# Altium schematic sheet MCU_Module.SchDoc: MCU Module
size A3; DocumentNumber: 4; SheetNumber: 4; SheetTotal: 51
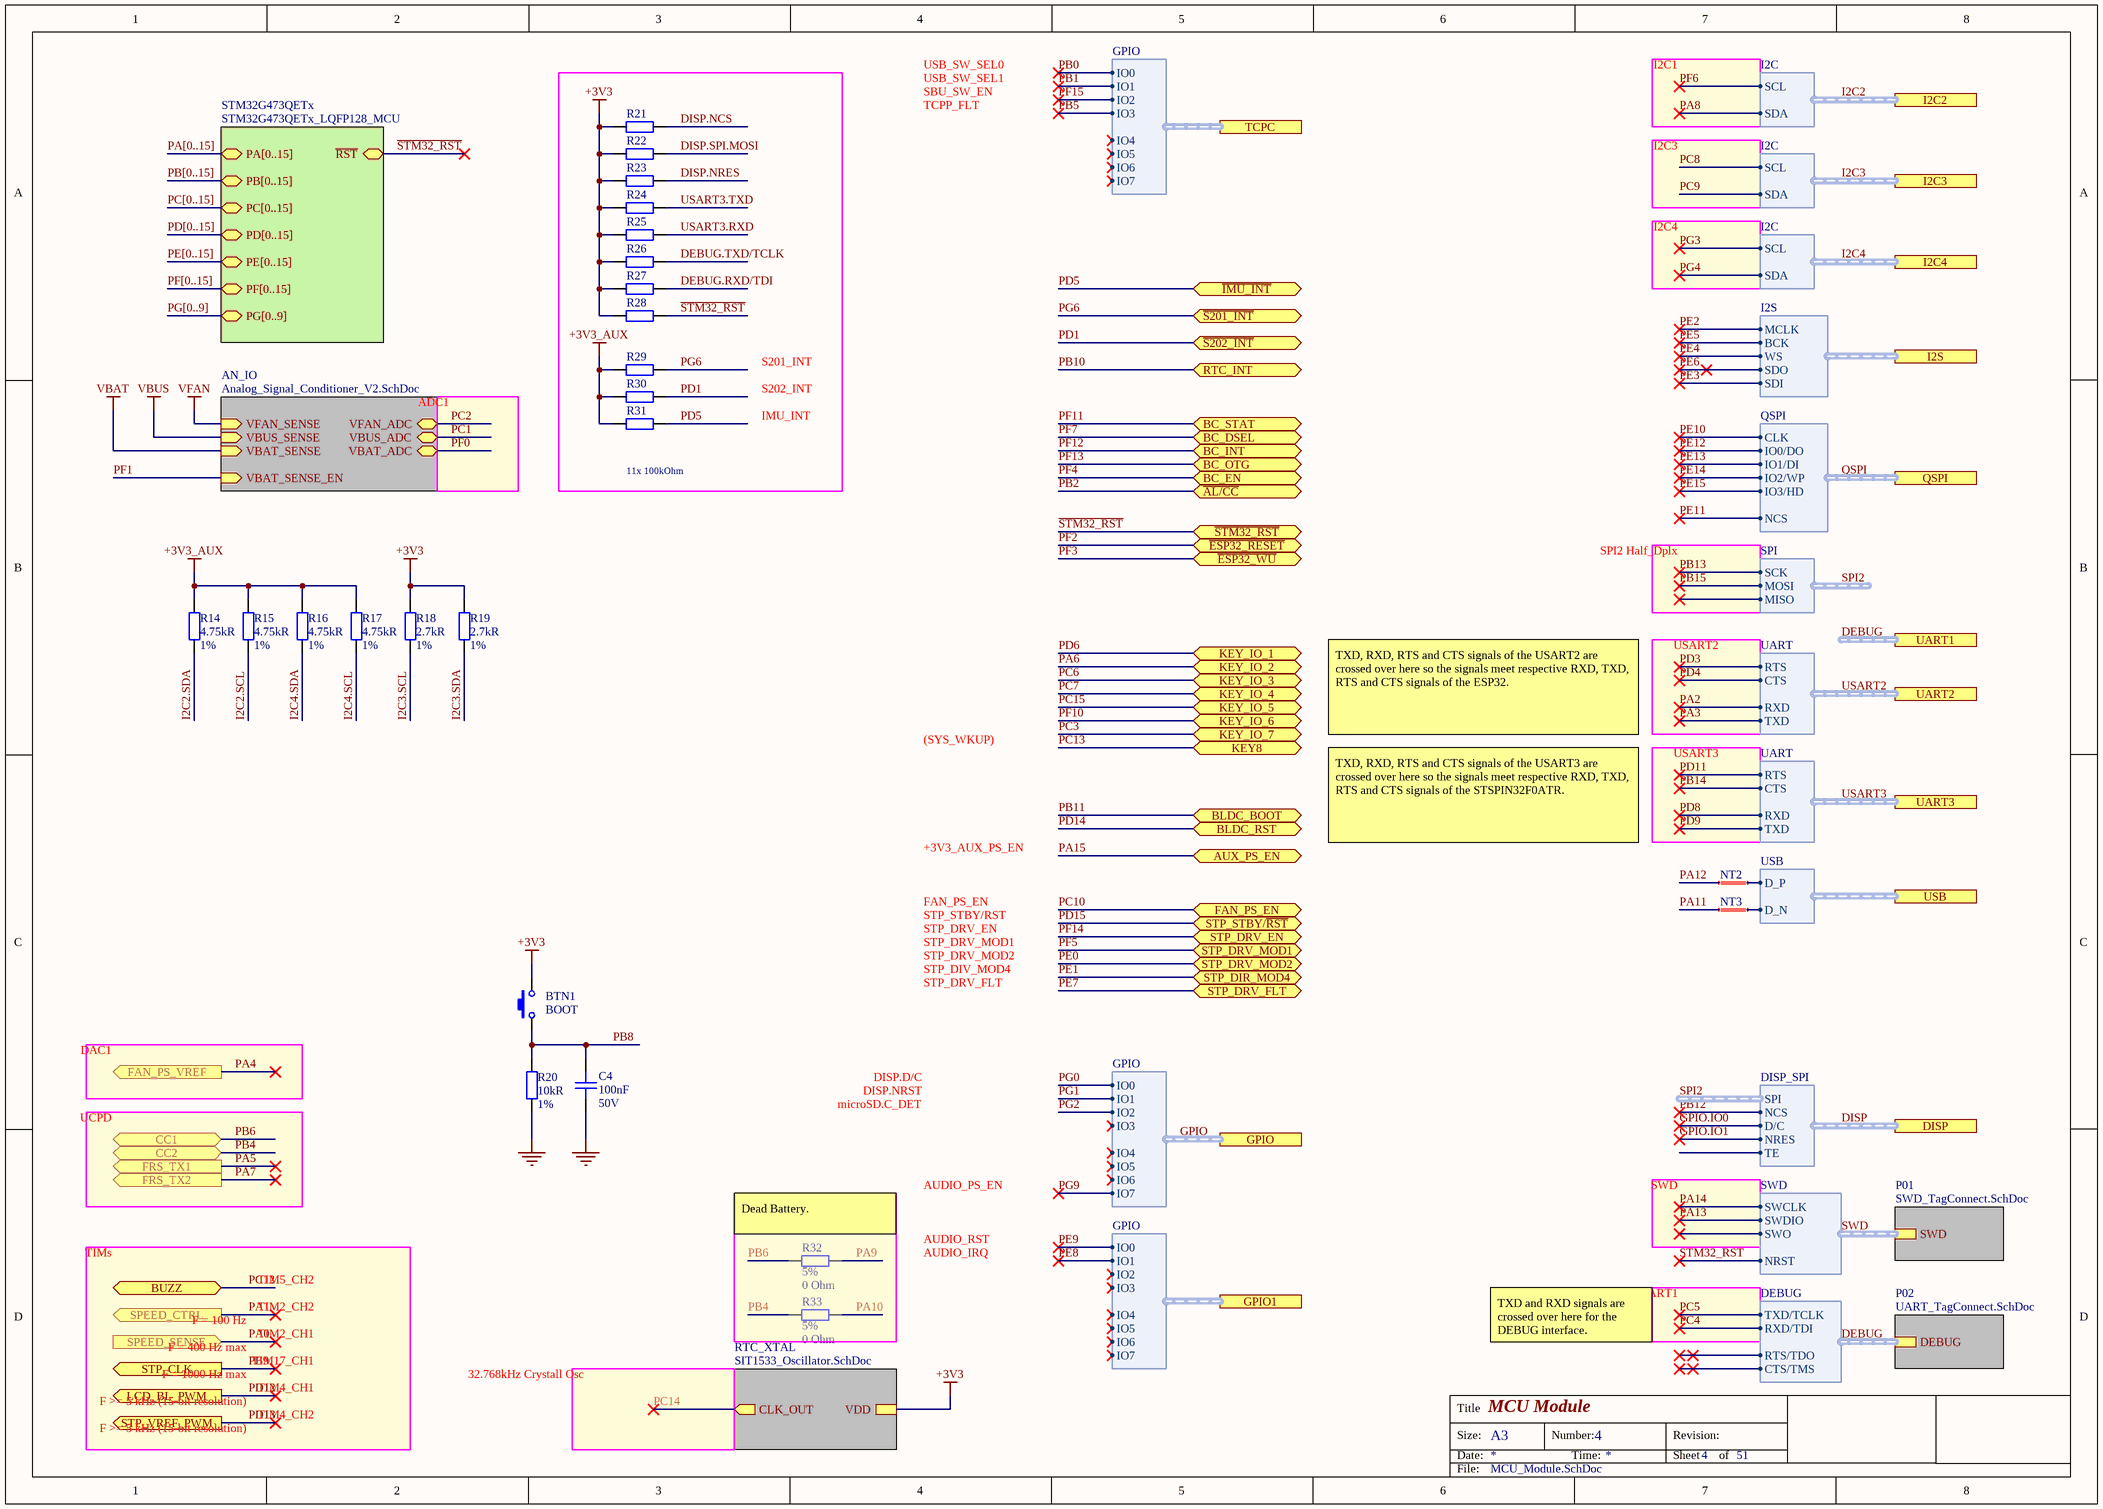
[diagram p0: MCU_Module.SchDoc]

## Parts
BTN1  BOOT  [SWITCH USLPT2819DT2TR TACTILE TE]
C4  Capacitance: 100nF  Voltage: 50V  [C0402]  (hidden comment: CAP CER 0.1UF 50V X7R 0402)
NT2  Net Tie  [Net Tie 6x30mil]  (value not drawn)  (net tie, no BOM)
NT3  Net Tie  [Net Tie 6x30mil]  (value not drawn)  (net tie, no BOM)
R14  Resistance: 4.75kR  Tolerance: 1%  [R0402]  (hidden comment: RES SMD 4.75K OHM 1% 1/16W 0402)
R15  Resistance: 4.75kR  Tolerance: 1%  [R0402]  (hidden comment: RES SMD 4.75K OHM 1% 1/16W 0402)
R16  Resistance: 4.75kR  Tolerance: 1%  [R0402]  (hidden comment: RES SMD 4.75K OHM 1% 1/16W 0402)
R17  Resistance: 4.75kR  Tolerance: 1%  [R0402]  (hidden comment: RES SMD 4.75K OHM 1% 1/16W 0402)
R18  Resistance: 2.7kR  Tolerance: 1%  [R0402]  (hidden comment: RES SMD 2.7K OHM 1% 1/16W 0402)
R19  Resistance: 2.7kR  Tolerance: 1%  [R0402]  (hidden comment: RES SMD 2.7K OHM 1% 1/16W 0402)
R20  Resistance: 10kR  Tolerance: 1%  [R0402]  (hidden comment: RES SMD 10K OHM 1% 1/16W 0402)
R21  RES SMD 100K OHM 1% 1/16W 0402  [R0402]  (value not drawn)
R22  RES SMD 100K OHM 1% 1/16W 0402  [R0402]  (value not drawn)
R23  RES SMD 100K OHM 1% 1/16W 0402  [R0402]  (value not drawn)
R24  RES SMD 100K OHM 1% 1/16W 0402  [R0402]  (value not drawn)
R25  RES SMD 100K OHM 1% 1/16W 0402  [R0402]  (value not drawn)
R26  RES SMD 100K OHM 1% 1/16W 0402  [R0402]  (value not drawn)
R27  RES SMD 100K OHM 1% 1/16W 0402  [R0402]  (value not drawn)
R28  RES SMD 100K OHM 1% 1/16W 0402  [R0402]  (value not drawn)
R29  RES SMD 100K OHM 1% 1/16W 0402  [R0402]  (value not drawn)
R30  RES SMD 100K OHM 1% 1/16W 0402  [R0402]  (value not drawn)
R31  RES SMD 100K OHM 1% 1/16W 0402  [R0402]  (value not drawn)
R32  Tolerance: 5%  Resistance: 0 Ohm  [R0402]  (hidden comment: RES SMD 0 OHM JUMPER 1/16W 0402)
R33  Tolerance: 5%  Resistance: 0 Ohm  [R0402]  (hidden comment: RES SMD 0 OHM JUMPER 1/16W 0402)

## Sub-sheets
AN_IO = Analog_Signal_Conditioner_V2.SchDoc: VFAN_SENSE (in), VBUS_SENSE (in), VFAN_ADC (bidir), VBUS_ADC (bidir), VBAT_SENSE (in), VBAT_ADC (bidir), VBAT_SENSE_EN (in)
P01 = SWD_TagConnect.SchDoc: SWD (harness SWD)  | Caption: SWD
P02 = UART_TagConnect.SchDoc: DEBUG (harness DEBUG)  | Caption: DEBUG
RTC_XTAL = SIT1533_Oscillator.SchDoc: CLK_OUT (out), VDD
STM32G473QETx = STM32G473QETx_LQFP128_MCU: ~{RST} (bidir), PA[0..15] (bidir), PB[0..15] (bidir), PC[0..15] (bidir), PF[0..15] (bidir), PD[0..15] (bidir), PE[0..15] (bidir), PG[0..9] (bidir)

## Ports
AUX_PS_EN (bidir), BC_DSEL (bidir), BC_EN (bidir), BC_INT (bidir), BC_OTG (bidir), BC_STAT (bidir), BLDC_BOOT (bidir), BLDC_RST (bidir), BUZZ (bidir), CC1 (bidir), CC2 (bidir), DISP (harness DISP_SPI), FAN_PS_EN (bidir), FAN_PS_VREF (out), FRS_TX1 (out), FRS_TX2 (out), GPIO1 (harness GPIO), GPIO (harness GPIO), I2C2 (harness I2C), I2C3 (harness I2C), I2C4 (harness I2C), I2S (harness I2S), KEY8 (bidir), KEY_IO_1 (bidir), KEY_IO_2 (bidir), KEY_IO_3 (bidir), KEY_IO_4 (bidir), KEY_IO_5 (bidir), KEY_IO_6 (bidir), KEY_IO_7 (bidir), LCD_BL_PWM (out), QSPI (harness QSPI), RTC_INT (bidir), SPEED_CTRL (out), SPEED_SENSE (in), STP_CLK (out), STP_DIR_MOD4 (bidir), STP_DRV_EN (bidir), STP_DRV_FLT (bidir), STP_DRV_MOD1 (bidir), STP_DRV_MOD2 (bidir), STP_STBY/~{RST} (bidir), STP_VREF_PWM (out), TCPC (harness GPIO), UART1 (harness DEBUG), UART2 (harness UART), UART3 (harness UART), USB (harness USB), ~{AL/CC} (bidir), ~{ESP32_RESET} (bidir), ~{ESP32_WU} (bidir), ~{IMU_INT} (bidir), ~{S201_INT} (bidir), ~{S202_INT} (bidir), ~{STM32_RST} (bidir)

## Harnesses
SWD: SWDIO, SWCLK, NRST, SWO
DEBUG: TXD/TCLK, RXD/TDI, RTS/TDO, CTS/TMS
DISP_SPI: SPI, NCS, D/C, NRES, TE
USB: D_P, D_N
SPI: SCK, MISO, MOSI
QSPI: IO0/DO, IO1/DI, NCS, CLK, IO2/WP, IO3/HD
I2S: WS, SDI, BCK, SDO, MCLK
I2C: SCL, SDA
UART: RTS, CTS, RXD, TXD
GPIO: IO0, IO1, IO2, IO3, IO4, IO5, IO6, IO7
GPIO: IO0, IO1, IO2, IO4, IO6, IO7, IO3, IO5

## Nets
+3V3: BTN1.1 R18.2 R19.2 R21.1 R22.1 R23.1 R24.1 R25.1 R26.1 R27.1 R28.1 ; sheet RTC_XTAL/VDD
+3V3_AUX: R14.2 R15.2 R16.2 R17.2 R29.1 R30.1 R31.1
GND: C4.1 R20.2
VBAT: sheet AN_IO/VBAT_SENSE
VBUS: sheet AN_IO/VBUS_SENSE
VFAN: sheet AN_IO/VFAN_SENSE
~{STM32_RST}: R28.2 ; port ~{STM32_RST}, sheet STM32G473QETx/~{RST}, sheet P01/SWD.NRST
DEBUG.RXD/TDI: R27.2
DEBUG.TXD/TCLK: R26.2
DISP.NCS: R21.2
DISP.NRES: R23.2
DISP.SPI.MOSI: R22.2
GPIO.IO0: port DISP.D/C  [project net DISP.D/C]
GPIO.IO1: port DISP.NRES  [project net DISP.NRES]
I2C2.SCL: R15.1
I2C2.SDA: R14.1
I2C3.SCL: R18.1
I2C3.SDA: R19.1
I2C4.SCL: R17.1
I2C4.SDA: R16.1
PA0: port SPEED_SENSE
PA1: port SPEED_CTRL
PA2: port UART2.RXD
PA3: port UART2.TXD
PA4: port FAN_PS_VREF
PA5: port FRS_TX1
PA6: port KEY_IO_2
PA7: port FRS_TX2
PA8: port I2C2.SDA  [project net I2C2.SDA]
PA9: R32.2
PA10: R33.2
PA11: NT3.1
PA12: NT2.1
PA13: sheet P01/SWD.SWDIO
PA14: sheet P01/SWD.SWCLK
PA15: port AUX_PS_EN
PB0: port TCPC.IO0
PB1: port TCPC.IO1
PB2: port ~{AL/CC}
PB4: R33.1 ; port CC2
PB5: port TCPC.IO3
PB6: R32.1 ; port CC1
PB8: BTN1.2 C4.2 R20.1
PB9: port STP_CLK
PB10: port RTC_INT
PB11: port BLDC_BOOT
PB12: port DISP.NCS  [project net DISP.NCS]
PB13: harness SPI.SCK
PB14: port UART3.CTS
PB15: harness SPI.MOSI
PC1: sheet AN_IO/VBUS_ADC
PC2: sheet AN_IO/VFAN_ADC
PC3: port KEY_IO_7
PC4: port UART1.RXD/TDI  [project net DEBUG.RXD/TDI]
PC5: port UART1.TXD/TCLK  [project net DEBUG.TXD/TCLK]
PC6: port KEY_IO_3
PC7: port KEY_IO_4
PC8: port I2C3.SCL  [project net I2C3.SCL]
PC9: port I2C3.SDA  [project net I2C3.SDA]
PC10: port FAN_PS_EN
PC12: port BUZZ
PC13: port KEY8
PC14: sheet RTC_XTAL/CLK_OUT
PC15: port KEY_IO_5
PD1: R30.2 ; port ~{S202_INT}
PD3: port UART2.RTS
PD4: port UART2.CTS
PD5: R31.2 ; port ~{IMU_INT}
PD6: port KEY_IO_1
PD8: port UART3.RXD
PD9: port UART3.TXD
PD11: port UART3.RTS
PD12: port LCD_BL_PWM
PD13: port STP_VREF_PWM
PD14: port BLDC_RST
PD15: port STP_STBY/~{RST}
PE0: port STP_DRV_MOD2
PE1: port STP_DIR_MOD4
PE2: port I2S.MCLK
PE3: port I2S.SDI
PE4: port I2S.WS
PE5: port I2S.BCK
PE6: port I2S.SDO
PE7: port STP_DRV_FLT
PE8: port GPIO1.IO1
PE9: port GPIO1.IO0
PE10: port QSPI.CLK
PE11: port QSPI.NCS
PE12: port QSPI.IO0/DO
PE13: port QSPI.IO1/DI
PE14: port QSPI.IO2/WP
PE15: port QSPI.IO3/HD
PF0: sheet AN_IO/VBAT_ADC
PF1: sheet AN_IO/VBAT_SENSE_EN
PF2: port ~{ESP32_RESET}
PF3: port ~{ESP32_WU}
PF4: port BC_EN
PF5: port STP_DRV_MOD1
PF6: port I2C2.SCL  [project net I2C2.SCL]
PF7: port BC_DSEL
PF10: port KEY_IO_6
PF11: port BC_STAT
PF12: port BC_INT
PF13: port BC_OTG
PF14: port STP_DRV_EN
PF15: port TCPC.IO2
PG0: port GPIO.IO0  [project net GPIO.IO0]
PG1: port GPIO.IO1  [project net GPIO.IO1]
PG2: port GPIO.IO2  [project net GPIO.IO2]
PG3: port I2C4.SCL  [project net I2C4.SCL]
PG4: port I2C4.SDA  [project net I2C4.SDA]
PG6: R29.2 ; port ~{S201_INT}
PG9: port GPIO.IO7  [project net GPIO.IO7]
USART3.RXD: R25.2
USART3.TXD: R24.2
NetNT2_2: NT2.2 ; port USB.D_P
NetNT3_2: NT3.2 ; port USB.D_N

## Buses and harness runs
bus PA[0..15] = sheet STM32G473QETx/PA[0..15]
bus PB[0..15] = sheet STM32G473QETx/PB[0..15]
bus PC[0..15] = sheet STM32G473QETx/PC[0..15]
bus PD[0..15] = sheet STM32G473QETx/PD[0..15]
bus PE[0..15] = sheet STM32G473QETx/PE[0..15]
bus PF[0..15] = sheet STM32G473QETx/PF[0..15]
bus PG[0..9] = sheet STM32G473QETx/PG[0..9]
harness DEBUG = port UART1
harness DEBUG = sheet P02/DEBUG
harness DISP = port DISP
harness GPIO = port GPIO
harness I2C2 = port I2C2
harness I2C3 = port I2C3
harness I2C4 = port I2C4
harness QSPI = port QSPI
harness SWD = sheet P01/SWD
harness USART2 = port UART2
harness USART3 = port UART3

## Notes on the sheet
- USB_SW_SEL0
- USB_SW_SEL1
- SBU_SW_EN
- TCPP_FLT
- I2C1
- I2C3
- I2C4
- S201_INT
- ADC1
- S202_INT
- IMU_INT
- (near R31) 11x 100kOhm
- SPI2 Half_Dplx
- USART2
- (SYS_WKUP)
- TXD, RXD, RTS and CTS signals of the USART2 are crossed over here so the signals meet respective RXD, TXD, RTS and CTS signals of the ESP32.
- USART3
- +3V3_AUX_PS_EN
- TXD, RXD, RTS and CTS signals of the USART3 are crossed over here so the signals meet respective RXD, TXD, RTS and CTS signals of the STSPIN32F0ATR.
- FAN_PS_EN
- STP_STBY/RST
- STP_DRV_MOD1
- STP_DRV_MOD2
- STP_DIV_MOD4
- STP_DRV_FLT
- STP_DRV_EN
- DAC1
- UCPD
- DISP.D/C
- DISP.NRST
- microSD.C_DET
- AUDIO_PS_EN
- SWD
- TIMs
- (near R32) Dead Battery.
- AUDIO_RST
- AUDIO_IRQ
- F = 100 Hz
- TIM2_CH2
- TIM5_CH2
- USART1
- F = 400 Hz max
- F = 1000 Hz max
- TIM17_CH1
- TIM4_CH1
- TIM2_CH1
- 32.768kHz Crystall Osc
- TXD and RXD signals are crossed over here for the DEBUG interface.
- F >= 5 kHz (15-bit resolution)
- TIM4_CH2
- Title
- Size:
- Date:
- A3
- Number:
- Time:
- Revision:
- Sheet
- of
- File:

## Library data of the parts
BTN1 = TACT ULTRA TB 2.8X1.9X0.6 160GF: Tactile Switch SPST-NO Top Actuated Surface Mount; Manufacturer: TE Connectivity; Manufacturer Part Number: USLPT2819DT2TR; Mechanical Life: 300000Cycles; Operating Force: 160gf; Throw Configuration: SPST; Illumination Type: Non-Illuminated; Switch Travel: 0.13mm; Switch Function: Off-Mom; Actuator Type: Standard; Actuator Material: Nylon,Polyamide; Supplier 1: Digi-Key; Stock 1: 7628; Pricing 1: 1=0.66, 10=0.636, 25=0.612, 100=0.5297, 250=0.4826, 500=0.4473, 1000=0.4002, 2500=0.379 (USD); Mount: Surface Mount; Min Operating Temperature: -40°C; Max Operating Temperature: 85°C; Packaging: Tape and Reel; Termination: SMD/SMT; ComponentLink1URL: https://www.te.com/commerce/DocumentDelivery/DDEController?Action=srchrtrv&amp;DocNm=2337225&amp;DocType=Customer+Drawing&amp;DocLang=English&src-supplier=Digi-Key; ComponentLink1Description: https://www.te.com/commerce/DocumentDelivery/DDEController?Action=srchrtrv&amp;DocNm=2337225&amp;DocType=Customer+Drawing&amp;DocLang=English&src-supplier=Digi-Key; Supplier Part Number 1: 450-3358-1-ND
C4 = CAP CER 0.1UF 50V X7R 0402: 0.1µF ±10% 50V Ceramic Capacitor X7R 0402 (1005 Metric); Manufacturer: TDK; Manufacturer Part Number: CGA2B3X7R1H104K050BB; Supplier 1: Digi-Key; Stock 1: 2925303; Pricing 1: 1=0.17, 10=0.118, 50=0.0668, 100=0.0553, 500=0.0388, 1000=0.0321, 2500=0.0299, 5000=0.0273 (USD); Mount: Surface Mount; Case/Package: 0402; Weight: 2.3E-05oz; Case Code (Metric): 1005; Case Code (Imperial): 0402; Min Operating Temperature: -55°C; Max Operating Temperature: 125°C; Voltage Rating: 50V; Tolerance: 10%; Packaging: Tape and Reel; Package Quantity: 1; Voltage Rating (DC): 50V; Dielectric: X7R; Termination: SMD/SMT; Composition: Ceramic; Length: 1mm; Height: 0.5mm; Width: 0.02inch; Thickness: 0.022inch; Depth: 0.5mm; Ratings: AEC-Q200; REACH SVHC: No SVHC; Lead Free: Lead Free; ComponentLink1URL: http://product.tdk.com/capacitor/mlcc/en/documents/mlccspec_automotive_general_midvoltage_en.pdf?src-supplier=Future+Electronics; ComponentLink1Description: http://product.tdk.com/capacitor/mlcc/en/documents/mlccspec_automotive_general_midvoltage_en.pdf?src-supplier=Future+Electronics; ComponentLink2URL: http://www.farnell.com/datasheets/1807242.pdf?src-supplier=Element14; ComponentLink2Description: http://www.farnell.com/datasheets/1807242.pdf?src-supplier=Element14; ComponentLink3URL: http://www.mouser.com/ds/2/400/lcc_automotive_general_en-843974.pdf?src-supplier=Mouser; ComponentLink3Description: http://www.mouser.com/ds/2/400/lcc_automotive_general_en-843974.pdf?src-supplier=Mouser; ComponentLink4URL: http://www.farnell.com/datasheets/1936565.pdf?src-supplier=Element14; ComponentLink4Description: http://www.farnell.com/datasheets/1936565.pdf?src-supplier=Element14; ComponentLink5URL: http://www.farnell.com/datasheets/1735392.pdf?src-supplier=Element14; ComponentLink5Description: http://www.farnell.com/datasheets/1735392.pdf?src-supplier=Element14; Supplier Part Number 1: 445-6899-1-ND
NT2 NT3 = Net Tie Line: ClassName: STM32G473CETx
R14-R17 = RES SMD 4.75K OHM 1% 1/16W 0402: 4.75 kOhms ±1% 0.063W, 1/16W Chip Resistor 0402 (1005 Metric) Moisture Resistant Thick Film; Manufacturer: Yageo; Manufacturer Part Number: RC0402FR-074K75P; Max Power Dissipation: 63mW; Temperature Coefficient: 150ppm/°C; Case/Package: 0402; Supplier 1: Digi-Key; Stock 1: 23485; Pricing 1: 1=0.1, 10=0.035, 100=0.014, 1000=0.0063, 2500=0.0055, 5000=0.0045 (USD); Case Code (Metric): 1005; Case Code (Imperial): 0402; Min Operating Temperature: -55°C; Max Operating Temperature: 155°C; Packaging: Tape and Reel; Composition: Thick Film; Number of Terminations: 2; Features: Moisture Resistant; Length: 0.039inch; Height: 0.016inch; Width: 0.02inch; ComponentLink1URL: http://www.yageo.com/NewPortal/yageodocoutput?fileName=/pdf/R-Chip/PYu-RC_51_RoHS_P_0.pdf&src-supplier=Digi-Key; ComponentLink1Description: http://www.yageo.com/NewPortal/yageodocoutput?fileName=/pdf/R-Chip/PYu-RC_51_RoHS_P_0.pdf&src-supplier=Digi-Key; ComponentLink2URL: http://www.yageo.com.tw/exep/pages/download/literatures/PYu-R_INT-thick_7.pdf?src-supplier=Digi-Key; ComponentLink2Description: http://www.yageo.com.tw/exep/pages/download/literatures/PYu-R_INT-thick_7.pdf?src-supplier=Digi-Key; Supplier Part Number 1: YAG1271CT-ND; ClassName: I2C_SW; Mount: Surface Mount
R18 R19 = RES SMD 2.7K OHM 1% 1/16W 0402: 2.7 kOhms ±1% 0.063W, 1/16W Chip Resistor 0402 (1005 Metric) Moisture Resistant Thick Film; Manufacturer: Yageo; Manufacturer Part Number: RC0402FR-072K7L; Power Rating: 63mW; Temperature Coefficient: 100ppm/°C; Voltage Rating: 50V; Supplier 1: Digi-Key; Stock 1: 261850; Pricing 1: 1=0.1, 10=0.016, 100=0.0064, 1000=0.0029, 2500=0.0025, 5000=0.0021 (USD); Case/Package: 0402; Case Code (Imperial): 0402; Case Code (Metric): 1005; Min Operating Temperature: -55°C; Max Operating Temperature: 155°C; Packaging: Tape and Reel; Package Quantity: 1; Termination: SMD/SMT; Composition: Thick Film; Number of Terminations: 2; Military Standard: Not; Max Power Dissipation: 63mW; Features: Moisture Resistant; Working Voltage: 50V; Length: 1mm; Height: 0.016inch; Width: 0.02inch; Depth: 0.5mm; REACH SVHC: Unknown; Lead Free: Lead Free; ComponentLink1URL: http://www.mouser.com/ds/2/447/PYu-RC0402_51_RoHS_L_6_r-8721.pdf?src-supplier=Mouser; ComponentLink1Description: http://www.mouser.com/ds/2/447/PYu-RC0402_51_RoHS_L_6_r-8721.pdf?src-supplier=Mouser; ComponentLink2URL: http://www.yageo.com/documents/recent/PYu-RC_Group_51_RoHS_L_9.pdf?src-supplier=Digi-Key; ComponentLink2Description: http://www.yageo.com/documents/recent/PYu-RC_Group_51_RoHS_L_9.pdf?src-supplier=Digi-Key; ComponentLink3URL: http://www.yageo.com/documents/recent/PYu-RC_Group_51_RoHS_L_10.pdf?src-supplier=Digi-Key; ComponentLink3Description: http://www.yageo.com/documents/recent/PYu-RC_Group_51_RoHS_L_10.pdf?src-supplier=Digi-Key; ComponentLink4URL: http://www.farnell.com/datasheets/2167052.pdf?src-supplier=Element14; ComponentLink4Description: http://www.farnell.com/datasheets/2167052.pdf?src-supplier=Element14; Supplier Part Number 1: 311-2.70KLRCT-ND; ClassName: STM32G473CETx; Mount: Surface Mount
R20 = RES SMD 10K OHM 1% 1/16W 0402: 10 kOhms ±1% 0.063W, 1/16W Chip Resistor 0402 (1005 Metric) Moisture Resistant Thick Film; Manufacturer Part Number: RC0402FR-0710KP; Manufacturer: Yageo; Temperature Coefficient: 150ppm/°C; Max Power Dissipation: 63mW; Supplier 1: Digi-Key; Stock 1: 839368; Pricing 1: 1=0.1, 10=0.035, 100=0.014, 1000=0.0063, 2500=0.0055, 5000=0.0045 (USD); Case Code (Imperial): 0402; Case Code (Metric): 1005; Min Operating Temperature: -55°C; Max Operating Temperature: 155°C; Composition: Thick Film; Packaging: Tape and Reel; Number of Terminations: 2; Length: 0.039inch; Height: 0.016inch; Width: 0.02inch; ComponentLink1URL: http://www.yageo.com/NewPortal/yageodocoutput?fileName=/pdf/R-Chip/PYu-RC_51_RoHS_P_0.pdf&src-supplier=Digi-Key; ComponentLink1Description: http://www.yageo.com/NewPortal/yageodocoutput?fileName=/pdf/R-Chip/PYu-RC_51_RoHS_P_0.pdf&src-supplier=Digi-Key; Supplier Part Number 1: YAG1249CT-ND; Case/Package: 0402; Features: Moisture Resistant; ClassName: STM32G473CETx; Mount: Surface Mount
R21-R31 = RES SMD 100K OHM 1% 1/16W 0402: 100 kOhms ±1% 0.063W, 1/16W Chip Resistor 0402 (1005 Metric) Moisture Resistant Thick Film; Manufacturer: Yageo; Manufacturer Part Number: RC0402FR-07100KL; Temperature Coefficient: 100ppm/°C; Power Rating: 63mW; Voltage Rating: 50V; Supplier 1: Digi-Key; Stock 1: 47448883; Pricing 1: 1=0.1, 10=0.016, 100=0.0064, 1000=0.0029, 2500=0.0025, 5000=0.0021 (USD); Case Code (Metric): 1005; Case Code (Imperial): 0402; Min Operating Temperature: -55°C; Max Operating Temperature: 155°C; Composition: Thick Film; Packaging: Tape and Reel; Termination: SMD/SMT; Military Standard: Not; Length: 0.039inch; Height: 0.016inch; Width: 0.02inch; Depth: 0.5mm; Lead Free: Lead Free; ComponentLink1URL: http://www.yageo.com/documents/recent/PYu-RC_Group_51_RoHS_L_10.pdf?src-supplier=Digi-Key; ComponentLink1Description: http://www.yageo.com/documents/recent/PYu-RC_Group_51_RoHS_L_10.pdf?src-supplier=Digi-Key; ComponentLink2URL: http://www.farnell.com/datasheets/1018594.pdf?src-supplier=Element14; ComponentLink2Description: http://www.farnell.com/datasheets/1018594.pdf?src-supplier=Element14; ComponentLink3URL: http://www.yageo.com/documents/recent/PYu-RC_Group_51_RoHS_L_9.pdf?src-supplier=Verical; ComponentLink3Description: http://www.yageo.com/documents/recent/PYu-RC_Group_51_RoHS_L_9.pdf?src-supplier=Verical; Supplier Part Number 1: 311-100KLRDKR-ND; Case/Package: 0402; Tolerance: 1%; Resistance: 100 kOhm; Package Quantity: 1; Number of Terminations: 2; Max Power Dissipation: 63mW; Working Voltage: 50V; Features: Moisture Resistant; REACH SVHC: No SVHC; ComponentLink4URL: http://www.yageo.com/documents/recent/PYu-RC_Group_51_RoHS_L_9.pdf?src-supplier=Mouser; ComponentLink4Description: http://www.yageo.com/documents/recent/PYu-RC_Group_51_RoHS_L_9.pdf?src-supplier=Mouser; ComponentLink5URL: http://documents.rs-components.com/techlib://itc_doclist_GB.htm?stockno=6185797&src-supplier=RSComponents; ComponentLink5Description: http://documents.rs-components.com/techlib://itc_doclist_GB.htm?stockno=6185797&src-supplier=RSComponents; Mount: Surface Mount
R32 R33 = RES SMD 0 OHM JUMPER 1/16W 0402: 0 Ohms Jumper 0.063W, 1/16W Chip Resistor 0402 (1005 Metric) Moisture Resistant Thick Film; Manufacturer: Yageo; Manufacturer Part Number: RC0402JR-070RL; Power Rating: 62.5mW; Voltage Rating: 50V; Max Power Dissipation: 63mW; Temperature Coefficient: 200ppm/°C; Case/Package: 0402; Supplier 1: Digi-Key; Stock 1: 46057148; Pricing 1: 1=0.1, 10=0.013, 25=0.0092, 50=0.0072, 100=0.0053, 250=0.004, 500=0.0032, 1000=0.0024, 5000=0.0017 (USD); Contact Plating: Tin,Matte; Case Code (Metric): 1005; Case Code (Imperial): 0402; Min Operating Temperature: -55°C; Max Operating Temperature: 155°C; Packaging: Tape and Reel; Composition: Thick Film; Package Quantity: 1; Number of Terminations: 2; Termination: SMD/SMT; Military Standard: Not; Features: Moisture Resistant; Length: 1mm; Height: 0.016inch; Width: 0.02inch; Depth: 0.5mm; Radiation Hardening: No; REACH SVHC: Unknown; Lead Free: Lead Free; ComponentLink1URL: http://www.yageo.com/documents/recent/PYu-RC_Group_51_RoHS_L_10.pdf?src-supplier=Digi-Key; ComponentLink1Description: http://www.yageo.com/documents/recent/PYu-RC_Group_51_RoHS_L_10.pdf?src-supplier=Digi-Key; ComponentLink2URL: http://www.yageo.com/documents/recent/PYu-RC0402_51_RoHS_L_6.pdf?src-supplier=Avnet+Europe; ComponentLink2Description: http://www.yageo.com/documents/recent/PYu-RC0402_51_RoHS_L_6.pdf?src-supplier=Avnet+Europe; ComponentLink3URL: http://www.farnell.com/datasheets/1018594.pdf?src-supplier=Element14; ComponentLink3Description: http://www.farnell.com/datasheets/1018594.pdf?src-supplier=Element14; ComponentLink4URL: https://www.verical.com/server-webapp/html/getDatasheet?partID=326379&src-supplier=Verical; ComponentLink4Description: https://www.verical.com/server-webapp/html/getDatasheet?partID=326379&src-supplier=Verical; ComponentLink5URL: http://www.farnell.com/datasheets/2167052.pdf?src-supplier=Element14; ComponentLink5Description: http://www.farnell.com/datasheets/2167052.pdf?src-supplier=Element14; Supplier Part Number 1: 311-0.0JRCT-ND; ClassName: STM32G473CETx; Mount: Surface Mount